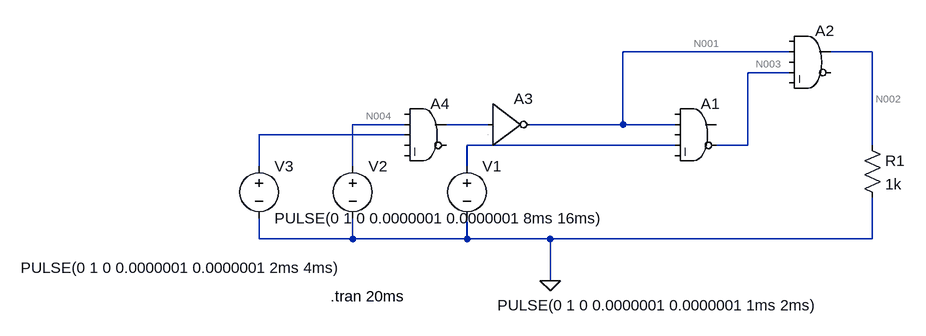
[diagram p0: schematic Draft2.asc]
Draft2.asc, the LTspice schematic file:
Version 4
SHEET 1 880 680
WIRE 288 48 32 48
WIRE 416 48 352 48
WIRE 288 80 224 80
WIRE -304 160 -384 160
WIRE -176 160 -240 160
WIRE 32 160 32 48
WIRE 32 160 -112 160
WIRE 112 160 32 160
WIRE -304 176 -528 176
WIRE 112 192 -208 192
WIRE 224 192 224 80
WIRE 224 192 176 192
WIRE 416 192 416 48
WIRE -528 224 -528 176
WIRE -384 224 -384 160
WIRE -208 224 -208 192
WIRE -528 336 -528 304
WIRE -384 336 -384 304
WIRE -384 336 -528 336
WIRE -208 336 -208 304
WIRE -208 336 -384 336
WIRE -80 336 -208 336
WIRE 416 336 416 272
WIRE 416 336 -80 336
WIRE -80 400 -80 336
FLAG -80 400 0
SYMBOL Digital\\and 144 112 R0
SYMATTR InstName A1
SYMBOL Digital\\and 320 0 R0
SYMATTR InstName A2
SYMBOL voltage -208 208 R0
WINDOW 3 47 230 Left 2
WINDOW 123 0 0 Left 0
WINDOW 39 0 0 Left 0
SYMATTR InstName V1
SYMATTR Value PULSE(0 1 0 0.0000001 0.0000001 1ms 2ms)
SYMBOL voltage -384 208 R0
WINDOW 3 -511 172 Left 2
WINDOW 123 0 0 Left 0
WINDOW 39 0 0 Left 0
SYMATTR InstName V2
SYMATTR Value PULSE(0 1 0 0.0000001 0.0000001 2ms 4ms)
SYMBOL res 400 176 R0
SYMATTR InstName R1
SYMATTR Value 1k
SYMBOL Digital\\inv -176 96 R0
SYMATTR InstName A3
SYMBOL voltage -528 208 R0
WINDOW 123 0 0 Left 0
WINDOW 39 0 0 Left 0
SYMATTR InstName V3
SYMATTR Value PULSE(0 1 0 0.0000001 0.0000001 8ms 16ms)
SYMBOL Digital\\and -272 112 R0
SYMATTR InstName A4
TEXT -418 424 Left 2 !.tran 20ms

The netlist it stands for:
* Draft2.asc
A1 0 N001 0 N007 0 N003 0 0 AND
A2 0 N001 0 N003 0 0 N002 0 AND
V1 N007 0 PULSE(0 1 0 0.0000001 0.0000001 1ms 2ms)
V2 N004 0 PULSE(0 1 0 0.0000001 0.0000001 2ms 4ms)
R1 N002 0 1k
A3 N005 0 0 0 0 N001 0 0 BUF
V3 N006 0 PULSE(0 1 0 0.0000001 0.0000001 8ms 16ms)
A4 0 N004 N006 0 0 0 N005 0 AND
.tran 20ms
.backanno
.end

* Results of the author's LTspice run, read from the files saved beside the schematic
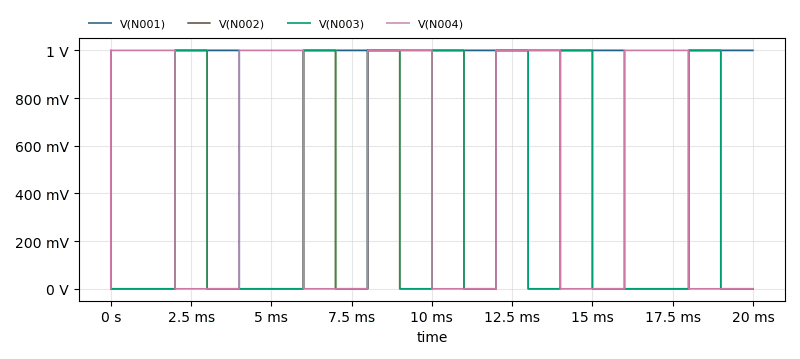
[diagram p1: Transient Analysis of Draft2.asc, plotted from the saved traces]
* Transient Analysis, 1 run:
*   V(N001): min 0 V, max 1 V, average 700 mV, rms 836.6 mV, last 1 V
*   V(N002): min 0 V, max 999 mV, average 349.7 mV, rms 591 mV, last 0 V
*   V(N003): min 0 V, max 1 V, average 350 mV, rms 591.6 mV, last 0 V
*   V(N004): min 0 V, max 1 V, average 500 mV, rms 707.1 mV, last 0 V